# Altium project Capteur.PrjPCB
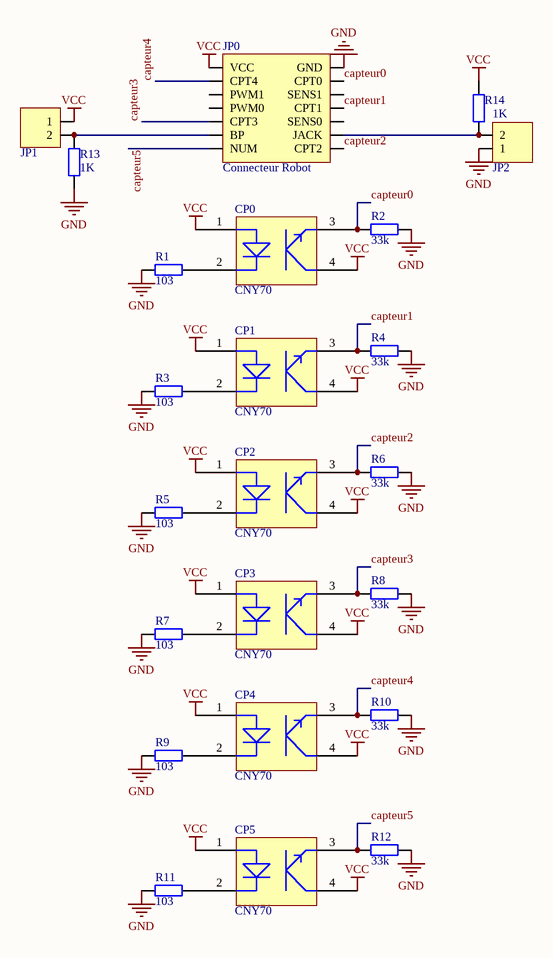
[diagram p0: Capteur.SchDoc]
1 sheet, 23 parts. Net scope: global (net labels, ports and power ports of the same name join across sheets).
Board file: Capteur.PcbDoc

## Sheet Capteur.SchDoc
size A4

### Parts
CP0  CNY70  [CNY70]
CP1  CNY70  [CNY70]
CP2  CNY70  [CNY70]
CP3  CNY70  [CNY70]
CP4  CNY70  [CNY70]
CP5  CNY70  [CNY70]
JP0  Connecteur Robot  [HE10 2x7]
JP1  Connecteur bipastille  [Conn_SIG_2pts]  (value not drawn)
JP2  Connecteur bipastille  [Conn_SIG_2pts]  (value not drawn)
R1  103  [Axial_4]
R2  33k  [Axial_4]
R3  103  [Axial_4]
R4  33k  [Axial_4]
R5  103  [Axial_4]
R6  33k  [Axial_4]
R7  103  [Axial_4]
R8  33k  [Axial_4]
R9  103  [Axial_4]
R10  33k  [Axial_4]
R11  103  [Axial_4]
R12  33k  [Axial_4]
R13  1K  [Axial_4]
R14  1K  [Axial_4]

### Nets
GND: JP0.2(GND) JP2.1 R1.1 R2.2 R3.1 R4.2 R5.1 R6.2 R7.1 R8.2 R9.1 R10.2 R11.1 R12.2 R13.1
VCC: CP0.1(A) CP0.4(C) CP1.1(A) CP1.4(C) CP2.1(A) CP2.4(C) CP3.1(A) CP3.4(C) CP4.1(A) CP4.4(C) CP5.1(A) CP5.4(C) JP0.1(VCC) JP1.1 R14.2
capteur0: CP0.3(E) JP0.4(CPT0) R2.1
capteur1: CP1.3(E) JP0.8(CPT1) R4.1
capteur2: CP2.3(E) JP0.14(CPT2) R6.1
capteur3: CP3.3(E) JP0.9(CPT3) R8.1
capteur4: CP4.3(E) JP0.3(CPT4) R10.1
capteur5: CP5.3(E) JP0.13(NUM) R12.1
NetCP0_2: CP0.2(K) R1.2
NetCP1_2: CP1.2(K) R3.2
NetCP2_2: CP2.2(K) R5.2
NetCP3_2: CP3.2(K) R7.2
NetCP4_2: CP4.2(K) R9.2
NetCP5_2: CP5.2(K) R11.2
NetJP0_11: JP0.11(BP) JP1.2 R13.2
NetJP0_12: JP0.12(JACK) JP2.2 R14.1

Not connected (* = marked no-connect by the designer): JP0 5(PWM1) 6(SENS1) 7(PWM0) 10(SENS0)

### Library data of the parts
CP0-CP5 = CNY70: Reflective optical sensor; Manufacturer: VISHAY SILICONIX; SVHC: No SVHC (15-Dec-2010); Courant, entrée: 50; Nombre de broches: 4; Nombre de voies: 1; Température de fonctionnement: -40°C à +85; Type de sortie: Phototransistor; ComponentLink1URL: http://www.vishay.com/docs/83751/cny70.pdf; ComponentLink1Description: Datasheet; Supplier 1: Farnell; Supplier Part Number 1: 1470063; Manufacturer Part Number: CNY70; RoHS: YES; Stock 1: 2007; Pricing 1: 1=1,27, 25=1,02, 100=0,73, 250=0,61, 500=0,54 (EUR)
JP0 = HE10 Robot: Connecteurr pour robot S1
JP1 JP2 = Connecteur bipastille: Double pastilles pour souder un moteur
R1-R14 = Res: Resistance; Published: 8-Jun-2000; Revision: July-2002: Re-released for DXP Platform.; Publisher: Altium Limited; Supplier 2: Farnell; Supplier Part Number 2: 2057836
  R1 R3 R5 R7 R9 R11: Value: 103
  R2 R4 R6 R8 R10 R12: Value: 33k
  R13 R14: Value: 1K